# Altium schematic sheet Sheet3.SchDoc
size 594 x 420 mm; PageSetup: Record=PageOptions|CenterHorizontal=True|CenterVertical=True|PrintScale=0.94|XCorrection=1.00|YCorrection=1.00|PrintKind=1|BorderSize=5000000|LeftOffset=0|BottomOffset=0|Orientation=1|PaperLength=1000|PaperWidth=1000|Scale=100|PaperSource=7|PrintQuality=-4|MediaType=1|DitherType=10|PaperKind=A4|PrintScaleMode=1; DecimalNumber: Децимальный номер; HeadOfSector: Нач. сектора; MainDevice: Перв.примен.; Name: Наименование
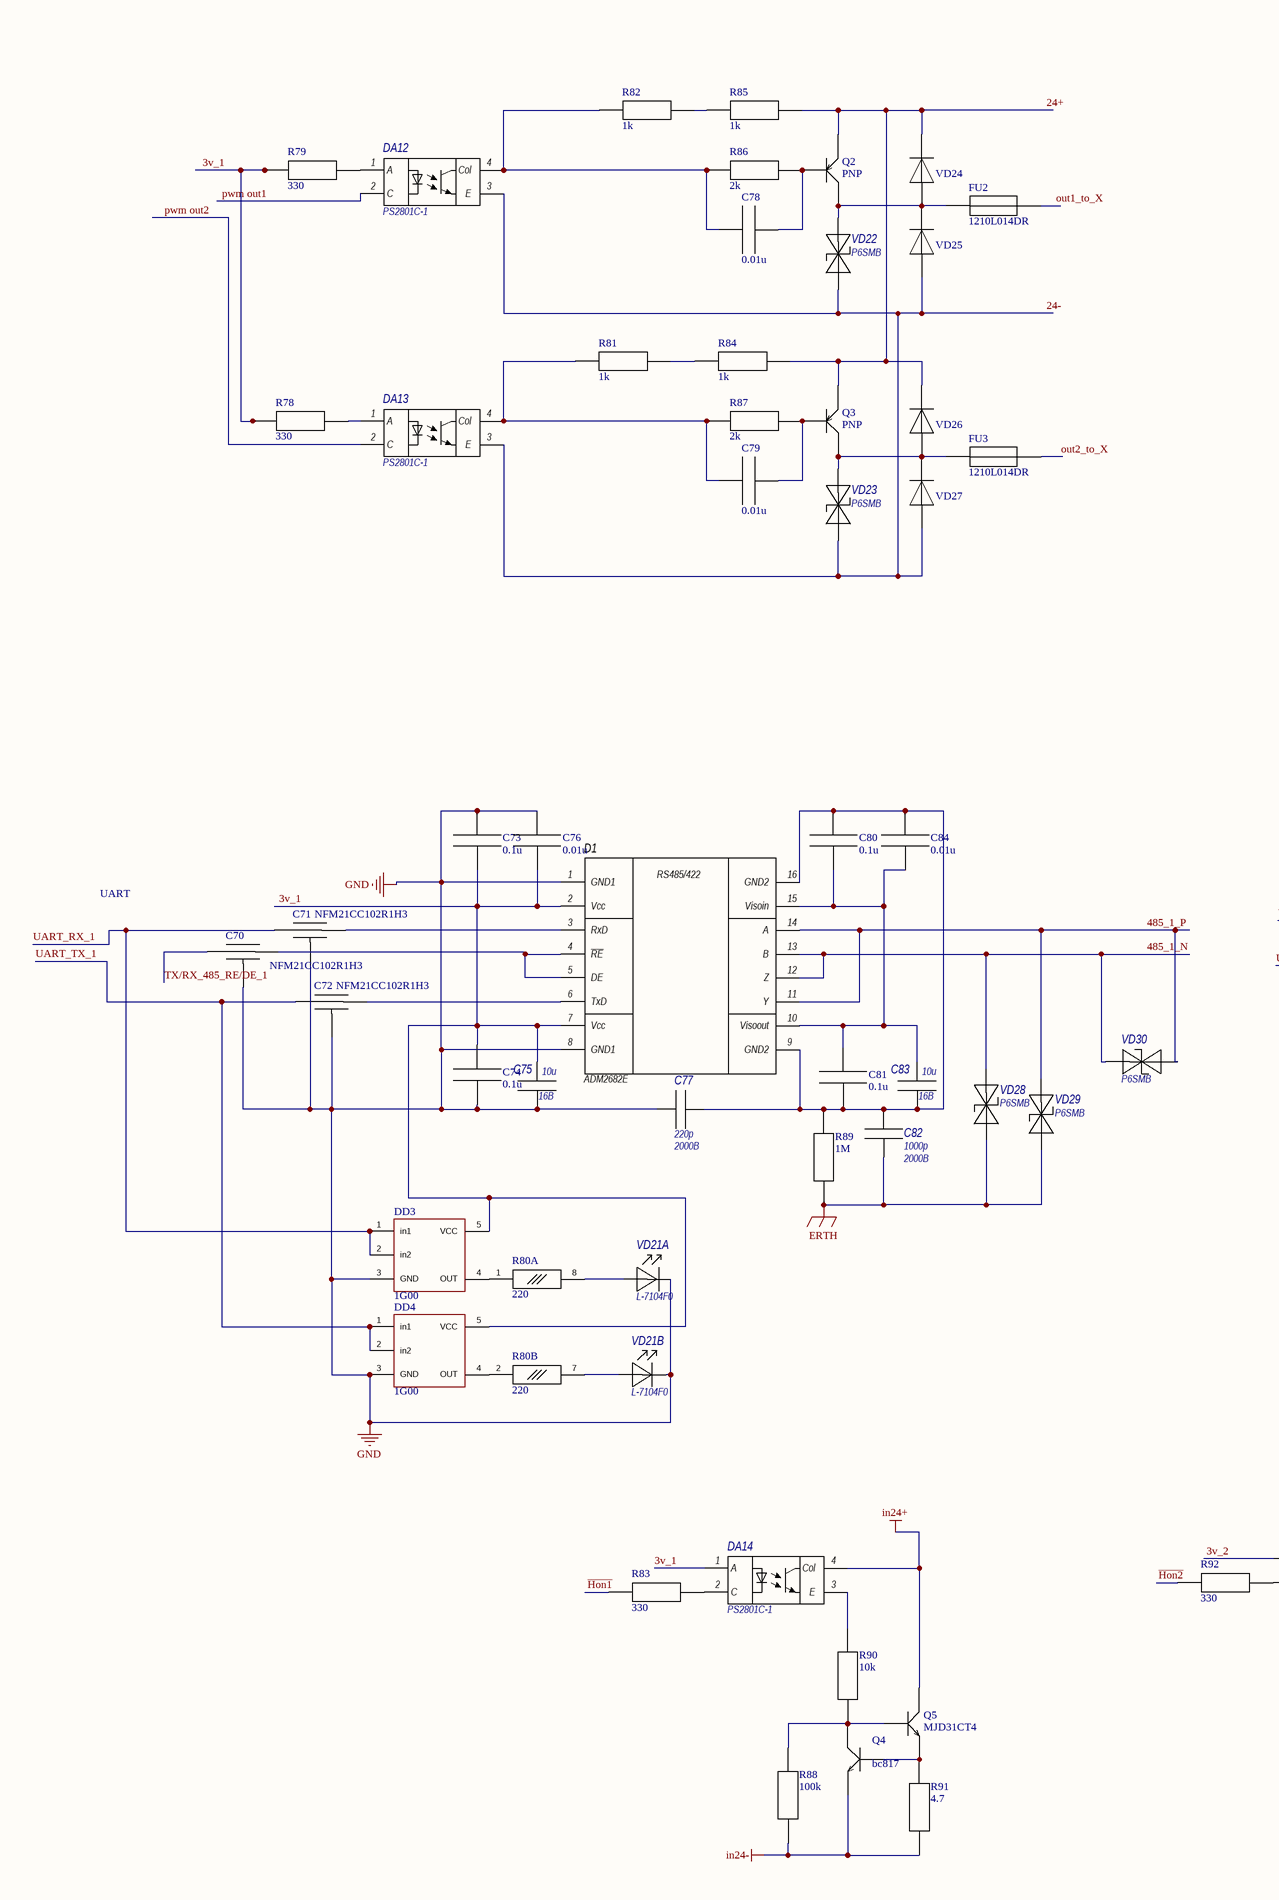
[diagram p0: Sheet3.SchDoc, left]
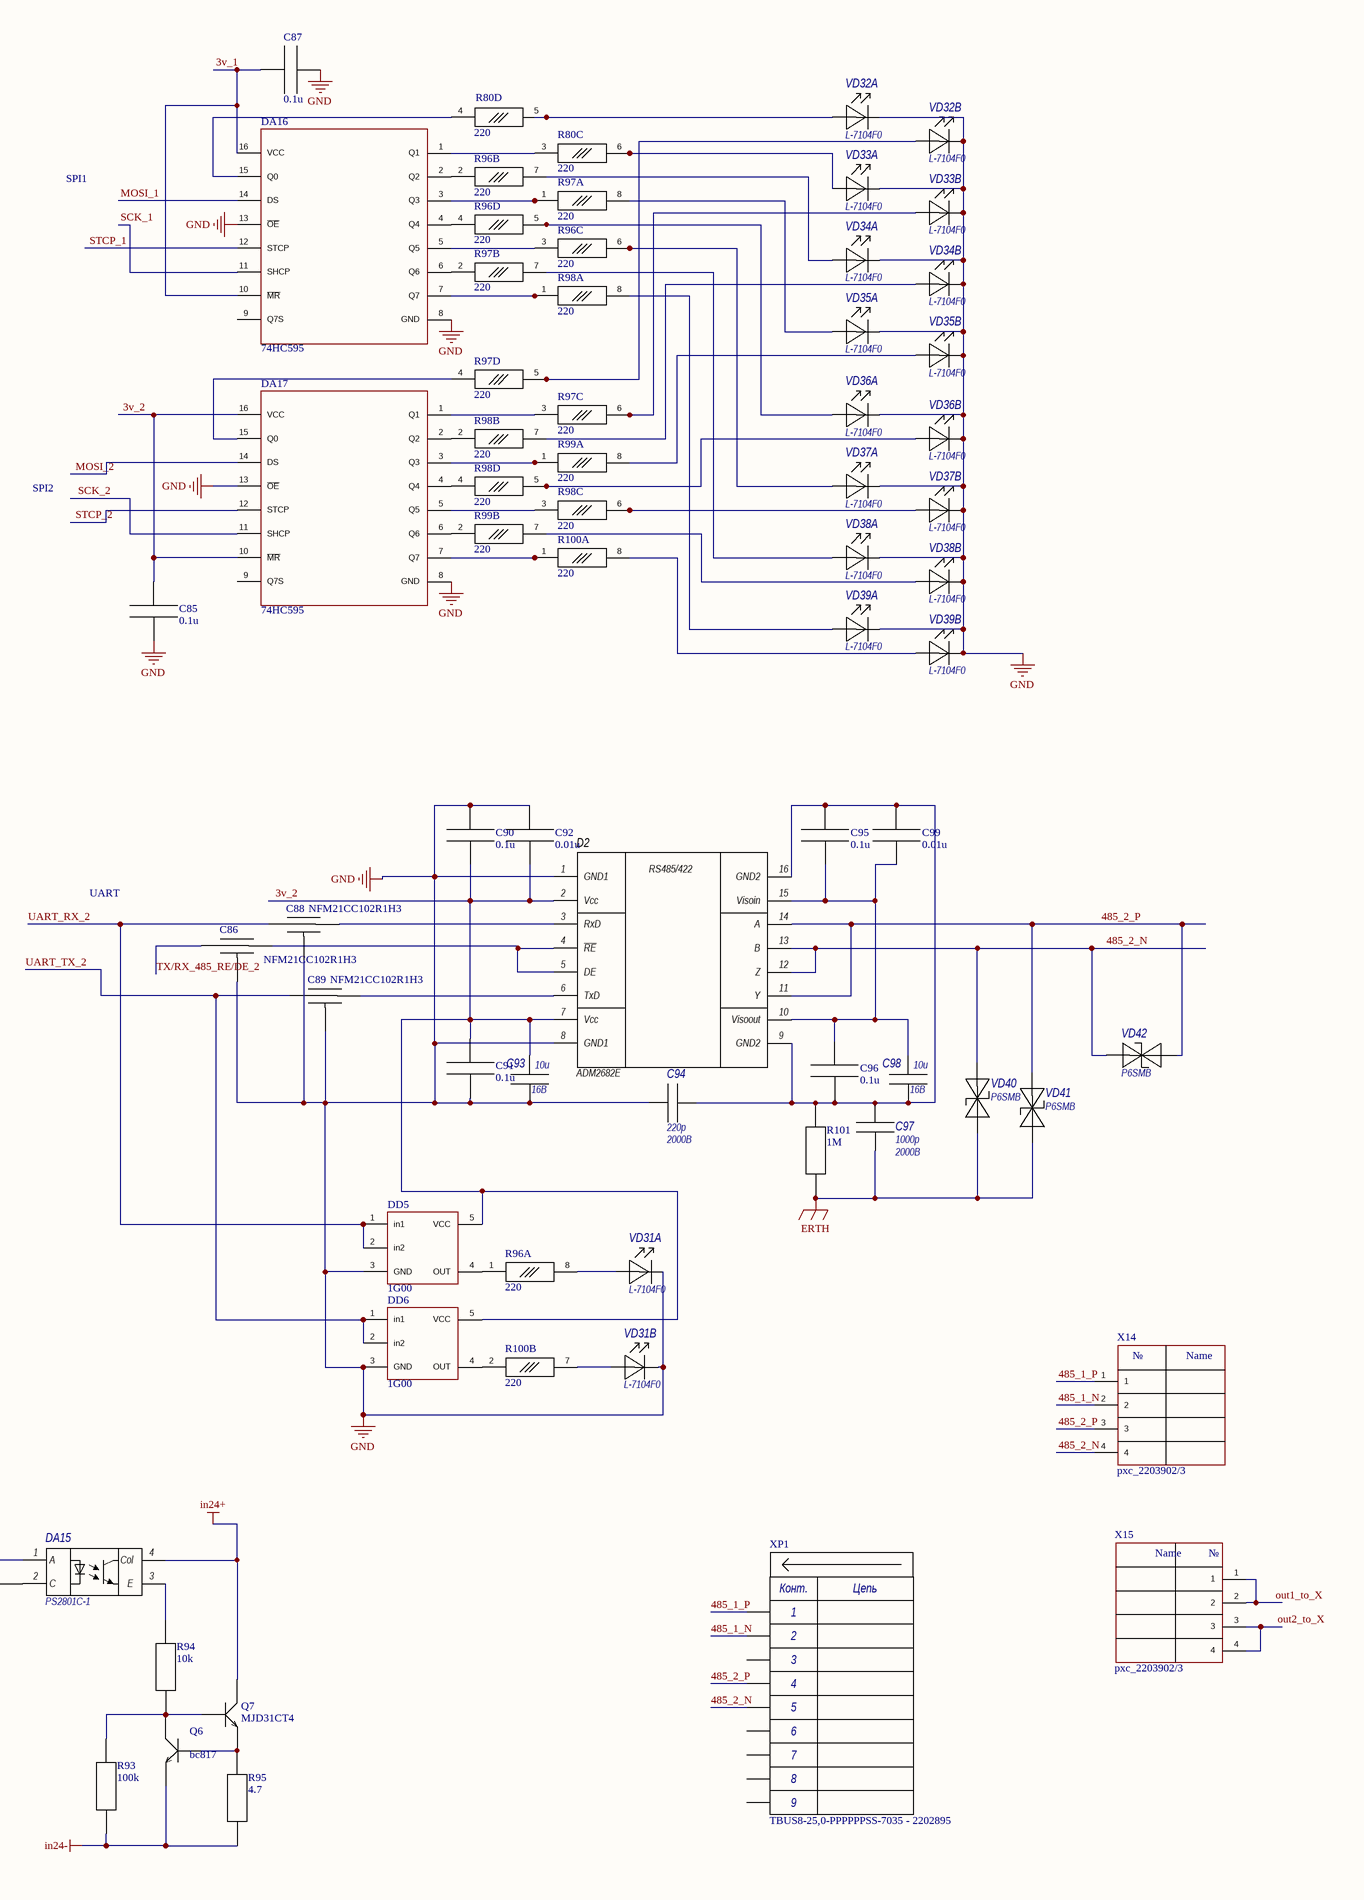
[diagram p1: Sheet3.SchDoc, right]

## Parts
C70  NFM21CC102R1H3  [NFM21C]
C71  NFM21CC102R1H3  [NFM21C]
C72  NFM21CC102R1H3  [NFM21C]
C73  0.1u  [cap_0402]
C74  0.1u  [cap_0402]
C75  value 10u  Voltage: 16В  [C0805_]  (hidden comment: 10u 16v)
C76  0.01u  [cap_0402]
C77  value 220p  Voltage: 2000В  [C1206_]  (hidden comment: 220p 2000v)
C78  0.01u  [cap_0402]
C79  0.01u  [cap_0402]
C80  0.1u  [cap_0402]
C81  0.1u  [cap_0402]
C82  value 1000p  Voltage: 2000В  [C1206_]  (hidden comment: 1000p 2000v)
C83  value 10u  Voltage: 16В  [C0805_]  (hidden comment: 10u 16v)
C84  0.01u  [cap_0402]
C85  0.1u  [cap_0402]
C86  NFM21CC102R1H3  [NFM21C]
C87  0.1u  [cap_0402]
C88  NFM21CC102R1H3  [NFM21C]
C89  NFM21CC102R1H3  [NFM21C]
C90  0.1u  [cap_0402]
C91  0.1u  [cap_0402]
C92  0.01u  [cap_0402]
C93  value 10u  Voltage: 16В  [C0805_]  (hidden comment: 10u 16v)
C94  value 220p  Voltage: 2000В  [C1206_]  (hidden comment: 220p 2000v)
C95  0.1u  [cap_0402]
C96  0.1u  [cap_0402]
C97  value 1000p  Voltage: 2000В  [C1206_]  (hidden comment: 1000p 2000v)
C98  value 10u  Voltage: 16В  [C0805_]  (hidden comment: 10u 16v)
C99  0.01u  [cap_0402]
D1  Type: ADM2682E  [SOIC_16IC_]  (hidden comment: ADM2682E_RS485_422_Isol)
D2  Type: ADM2682E  [SOIC_16IC_]  (hidden comment: ADM2682E_RS485_422_Isol)
DA12  PS2801C-1  [SSOP-4N]
DA13  PS2801C-1  [SSOP-4N]
DA14  PS2801C-1  [SSOP-4N]
DA15  PS2801C-1  [SSOP-4N]
DA16  74HC595  [TSSOP16]
DA17  74HC595  [TSSOP16]
DD3  1G00  [sot-23-5]
DD4  1G00  [sot-23-5]
DD5  1G00  [sot-23-5]
DD6  1G00  [sot-23-5]
FU2  1210L014DR  [fuse1210]
FU3  1210L014DR  [fuse1210]
Q2  PNP  [sot23]
Q3  PNP  [sot23]
Q4  bc817  [sot23]
Q5  MJD31CT4  [d-pak]
Q6  bc817  [sot23]
Q7  MJD31CT4  [d-pak]
R78  330  [res_0402]
R79  330  [res_0402]
R80  220  [YC164]  (parts A,B,C,D of 4)
R81  1k  [0805-res]
R82  1k  [0805-res]
R83  330  [res_0402]
R84  1k  [0805-res]
R85  1k  [0805-res]
R86  2k  [res_0402]
R87  2k  [res_0402]
R88  100k  [0805-res]
R89  1M  [0805-res]
R90  10k  [0805-res]
R91  4.7  [2512_res]
R92  330  [res_0402]
R93  100k  [0805-res]
R94  10k  [0805-res]
R95  4.7  [2512_res]
R96  220  [YC164]  (parts A,B,C,D of 4)
R97  220  [YC164]  (parts A,B,C,D of 4)
R98  220  [YC164]  (parts A,B,C,D of 4)
R99  220  [YC164]  (parts A,B of 4)
R100  220  [YC164]  (parts A,B of 4)
R101  1M  [0805-res]
VD21  Type: L-7104F0  [L-7104_]  (hidden comment: Diod_sv_L-7104F0)  (parts A,B of 2)
VD22  Type: P6SMB  [SOD-123]  (hidden comment: PTVS33VS1UTR)
VD23  Type: P6SMB  [SOD-123]  (hidden comment: PTVS33VS1UTR)
VD24  1N4448  [sod-323]  (value not drawn)
VD25  1N4448  [sod-323]  (value not drawn)
VD26  1N4448  [sod-323]  (value not drawn)
VD27  1N4448  [sod-323]  (value not drawn)
VD28  Type: P6SMB  [SOD-123]  (hidden comment: PTVS33VS1UTR)
VD29  Type: P6SMB  [SOD-123]  (hidden comment: PTVS33VS1UTR)
VD30  Type: P6SMB  [SOD-123]  (hidden comment: PTVS33VS1UTR)
VD31  Type: L-7104F0  [L-7104_]  (hidden comment: Diod_sv_L-7104F0)  (parts A,B of 2)
VD32  Type: L-7104F0  [L-7104_]  (hidden comment: Diod_sv_L-7104F0)  (parts A,B of 2)
VD33  Type: L-7104F0  [L-7104_]  (hidden comment: Diod_sv_L-7104F0)  (parts A,B of 2)
VD34  Type: L-7104F0  [L-7104_]  (hidden comment: Diod_sv_L-7104F0)  (parts A,B of 2)
VD35  Type: L-7104F0  [L-7104_]  (hidden comment: Diod_sv_L-7104F0)  (parts A,B of 2)
VD36  Type: L-7104F0  [L-7104_]  (hidden comment: Diod_sv_L-7104F0)  (parts A,B of 2)
VD37  Type: L-7104F0  [L-7104_]  (hidden comment: Diod_sv_L-7104F0)  (parts A,B of 2)
VD38  Type: L-7104F0  [L-7104_]  (hidden comment: Diod_sv_L-7104F0)  (parts A,B of 2)
VD39  Type: L-7104F0  [L-7104_]  (hidden comment: Diod_sv_L-7104F0)  (parts A,B of 2)
VD40  Type: P6SMB  [SOD-123]  (hidden comment: PTVS33VS1UTR)
VD41  Type: P6SMB  [SOD-123]  (hidden comment: PTVS33VS1UTR)
VD42  Type: P6SMB  [SOD-123]  (hidden comment: PTVS33VS1UTR)
X14  pxc_2203902/3  [pxc_2203903]
X15  pxc_2203902/3  [pxc_2203902]
XP1  TBUS8-25,0-PPPPPPSS-7035 - 2202895  [TBUS8-25,0-PPPPPPSS-7035 - 2202895]

## Nets
ERTH: C82.1 C97.1 R89.1 R101.1 VD28.A VD29.A VD40.A VD41.A
GND: C70.3(Gnd) C71.3(Gnd) C72.3(Gnd) C73.2 C74.1 C75.1 C76.2 C77.1 C85.1 C86.3(Gnd) C87.2 C88.3(Gnd) C89.3(Gnd) C90.2 C91.1 C92.1 C93.1 C94.1 D1.1(GND1) D1.8(GND1) D2.1(GND1) D2.8(GND1) DA16.8(GND) DA16.13(~{OE}) DA17.8(GND) DA17.13(~{OE}) DD3.3(GND) DD4.3(GND) DD5.3(GND) DD6.3(GND) VD21.2(K1) VD21.4(K2) VD31.2(K1) VD31.4(K2) VD32.2(K1) VD32.4(K2) VD33.2(K1) VD33.4(K2) VD34.2(K1) VD34.4(K2) VD35.2(K1) VD35.4(K2) VD36.2(K1) VD36.4(K2) VD37.2(K1) VD37.4(K2) VD38.2(K1) VD38.4(K2) VD39.2(K1) VD39.4(K2)
in24+: DA14.4(Col) DA15.4(Col) Q5.2(K) Q7.2(K)
in24-: Q4.3(E) Q6.3(E) R88.1 R91.1 R93.1 R95.1
3v_1: C73.1 C74.2 C75.2 C76.1 C87.1 D1.2(Vcc) D1.7(Vcc) DA14.1(A) DA16.10(~{MR}) DA16.16(VCC) DD3.5(VCC) DD4.5(VCC) R78.1 R79.1
3v_2: C85.2 C90.1 C91.2 C92.2 C93.2 D2.2(Vcc) D2.7(Vcc) DA15.1(A) DA17.10(~{MR}) DA17.16(VCC) DD5.5(VCC) DD6.5(VCC)
24+: Q2.3(K) Q3.3(K) R84.2 R85.2 VD24.K VD26.K
24-: DA12.3(E) DA13.3(E) VD22.A VD23.A VD25.A VD27.A
485_1_N: D1.12(Z) D1.13(B) VD28.K VD30.K X14.2 XP1.2(2c)
485_1_P: D1.11(Y) D1.14(A) VD29.K VD30.A X14.1 XP1.1(1c)
485_2_N: D2.12(Z) D2.13(B) VD40.K VD42.K X14.4 XP1.5(5c)
485_2_P: D2.11(Y) D2.14(A) VD41.K VD42.A X14.3 XP1.4(4c)
~{Hon1}: R83.1
~{Hon2}: R92.1
MOSI_1: DA16.14(DS)
MOSI_2: DA17.14(DS)
out1_to_X: FU2.2 X15.1 X15.2
out2_to_X: FU3.2 X15.3 X15.4
pwm out1: DA12.2(C)
pwm out2: DA13.2(C)
SCK_1: DA16.11(SHCP)
SCK_2: DA17.11(SHCP)
STCP_1: DA16.12(STCP)
STCP_2: DA17.12(STCP)
TX/RX_485_RE/DE_1: C70.1(in)
TX/RX_485_RE/DE_2: C86.1(in)
UART_RX_1: C71.1(in) DD3.1(in1) DD3.2(in2)
UART_RX_2: C88.1(in) DD5.1(in1) DD5.2(in2)
UART_TX_1: C72.1(in) DD4.1(in1) DD4.2(in2)
UART_TX_2: C89.1(in) DD6.1(in1) DD6.2(in2)
NetC70_2: C70.2(out) D1.4(~{RE}) D1.5(DE)
NetC71_2: C71.2(out) D1.3(RxD)
NetC72_2: C72.2(out) D1.6(TxD)
NetC77_2: C77.2 C80.2 C81.1 C82.2 C83.1 C84.2 D1.9(GND2) D1.16(GND2) R89.2
NetC78_1: C78.1 DA12.4(Col) R82.1 R86.1
NetC78_2: C78.2 Q2.1(B) R86.2
NetC79_1: C79.1 DA13.4(Col) R81.1 R87.1
NetC79_2: C79.2 Q3.1(B) R87.2
NetC80_1: C80.1 C81.2 C83.2 C84.1 D1.10(Visoout) D1.15(Visoin)
NetC86_2: C86.2(out) D2.4(~{RE}) D2.5(DE)
NetC88_2: C88.2(out) D2.3(RxD)
NetC89_2: C89.2(out) D2.6(TxD)
NetC94_2: C94.2 C95.2 C96.1 C97.2 C98.1 C99.2 D2.9(GND2) D2.16(GND2) R101.2
NetC95_1: C95.1 C96.2 C98.2 C99.1 D2.10(Visoout) D2.15(Visoin)
NetDA12_1: DA12.1(A) R79.2
NetDA13_1: DA13.1(A) R78.2
NetDA14_2: DA14.2(C) R83.2
NetDA14_3: DA14.3(E) R90.2
NetDA15_2: DA15.2(C) R92.2
NetDA15_3: DA15.3(E) R94.2
NetDA16_1: DA16.1(Q1) R80.3
NetDA16_2: DA16.2(Q2) R96.2
NetDA16_3: DA16.3(Q3) R97.1
NetDA16_4: DA16.4(Q4) R96.4
NetDA16_5: DA16.5(Q5) R96.3
NetDA16_6: DA16.6(Q6) R97.2
NetDA16_7: DA16.7(Q7) R98.1
NetDA16_15: DA16.15(Q0) R80.4
NetDA17_1: DA17.1(Q1) R97.3
NetDA17_2: DA17.2(Q2) R98.2
NetDA17_3: DA17.3(Q3) R99.1
NetDA17_4: DA17.4(Q4) R98.4
NetDA17_5: DA17.5(Q5) R98.3
NetDA17_6: DA17.6(Q6) R99.2
NetDA17_7: DA17.7(Q7) R100.1
NetDA17_15: DA17.15(Q0) R97.4
NetDD3_4: DD3.4(OUT) R80.1
NetDD4_4: DD4.4(OUT) R80.2
NetDD5_4: DD5.4(OUT) R96.1
NetDD6_4: DD6.4(OUT) R100.2
NetFU2_1: FU2.1 Q2.2(E) VD22.K VD24.A VD25.K
NetFU3_1: FU3.1 Q3.2(E) VD23.K VD26.A VD27.K
NetQ4_1: Q4.1(B) Q5.3(E) R91.2
NetQ4_2: Q4.2(K) Q5.1(B) R88.2 R90.1
NetQ6_1: Q6.1(B) Q7.3(E) R95.2
NetQ6_2: Q6.2(K) Q7.1(B) R93.2 R94.1
NetR80_5: R80.5 VD32.1(A1)
NetR80_6: R80.6 VD33.1(A1)
NetR80_7: R80.7 VD21.3(A2)
NetR80_8: R80.8 VD21.1(A1)
NetR81_2: R81.2 R84.1
NetR82_2: R82.2 R85.1
NetR96_5: R96.5 VD36.1(A1)
NetR96_6: R96.6 VD37.1(A1)
NetR96_7: R96.7 VD34.1(A1)
NetR96_8: R96.8 VD31.1(A1)
NetR97_5: R97.5 VD32.3(A2)
NetR97_6: R97.6 VD33.3(A2)
NetR97_7: R97.7 VD38.1(A1)
NetR97_8: R97.8 VD35.1(A1)
NetR98_5: R98.5 VD36.3(A2)
NetR98_6: R98.6 VD37.3(A2)
NetR98_7: R98.7 VD34.3(A2)
NetR98_8: R98.8 VD39.1(A1)
NetR99_7: R99.7 VD38.3(A2)
NetR99_8: R99.8 VD35.3(A2)
NetR100_7: R100.7 VD31.3(A2)
NetR100_8: R100.8 VD39.3(A2)

Not connected (* = marked no-connect by the designer): DA16 9(Q7S); DA17 9(Q7S); XP1 3(3c) 6(6c) 7(7e) 8(8e) 9

## Notes on the sheet
- SPI1
- SPI2
- UART
- Подп. и дата
- Инв.№ дубл.
- Взам.инв.№
- Подп.и дата
- Инв.№ подл.
- Изм.
- Лист
- № докум.
- Подп.
- Дата
- Формат  A2
- (in symbol ADM2682E_RS485_422_Isol) RS485/422
- (in symbol pxc_2203902/3) №; Name
- (in symbol TBUS8-25,0-PPPPPPSS-7035 - 2202895) Конт.; Цепь

## Library data of the parts
C70-C72 C86 C88 C89 = NFM21C
C73 C74 C76 C78-C81 C84 C85 C87 C90-C92 C95 C96 C99 = cap
C75 C83 C93 C98 = Capacitor ceramic: Capacitance: 10u x 16В; Dielectric: *; Tolerance: *
C77 C94 = Capacitor ceramic: Capacitance: 220p x 2000В; Dielectric: *; Tolerance: *
C82 C97 = Capacitor ceramic: Capacitance: 1000p x 2000В; Dielectric: *; Tolerance: *
DD3-DD6 = 1G00: 2NAND
FU2 FU3 = fuse
Q4 Q6 = npn
Q5 Q7 = npn: bc817
R78 R79 R81-R95 R101 = res
R80 R96-R100 = res_array: YC164
VD22 VD23 VD28-VD30 VD40-VD42 = PTVS33VS1UTR: PTVS33VS1UTR,115, TVS DIODE 33VWM 53.3VC SOD123W
DA12-DA15 = PS2801C-1: Type: PS2801C-1
XP1 = TBUS8-25,0-PPPPPPSS-7035 - 2202895: Type: TBUS8-25,0-PPPPPPSS-7035 - 2202895